# EAGLE design pogoToProg (EAGLE 7.1.0)
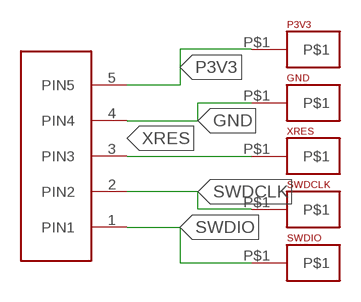
[diagram p0: schematic, sheet 1]

## Parts
GND  POGO-MATING  [POGO-MATING]
P3V3  POGO-MATING  [POGO-MATING]
SWDCLK  POGO-MATING  [POGO-MATING]
SWDIO  POGO-MATING  [POGO-MATING]
U$1  HEADER-5  [NON-5]
XRES  POGO-MATING  [POGO-MATING]

## Nets
GND: GND.P$1 U$1.4(PIN4)
P3V3: P3V3.P$1 U$1.5(PIN5)
SWDCLK: SWDCLK.P$1 U$1.2(PIN2)
SWDIO: SWDIO.P$1 U$1.1(PIN1)
XRES: U$1.3(PIN3) XRES.P$1

## Library data of the parts
GND P3V3 SWDCLK SWDIO XRES = FinalRev:POGO-MATING
U$1 = LAB1_BREAKOUT:HEADER-5: General 5 Pin 1 Row 2.54mm Spacing Connector

## Board
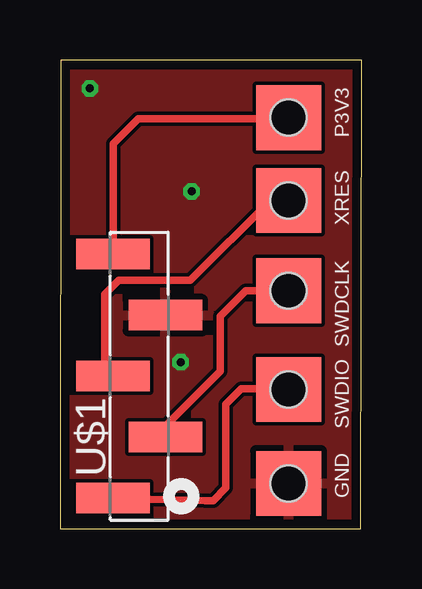
[diagram p1: board, top side]
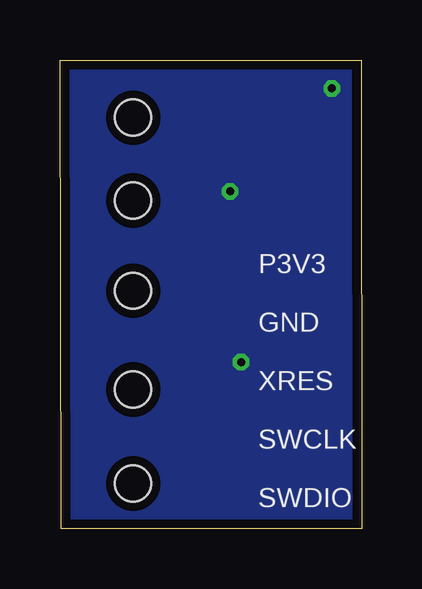
[diagram p2: board, bottom side, seen from below]

Size 12.57 x 19.52 mm. Coordinates in mm from the lower left corner, seen from the top.
Outline: 0,0 12.52,0 12.57,19.52 0.03,19.52 0,0
Copper layers (1*16): Top 0.0356mm / dielectric 1.5011mm / Bottom 0.0356mm
Design rules "LaenPCBOrder": minimum track width 6mil, minimum drill 13mil, track to track 6mil, track to pad 6mil, pad to pad 6mil, via to via 6mil, smd to smd 6mil, copper to edge 15mil, drill to drill 6mil, minimum pad ring 7mil, minimum via ring 7mil, stop-mask expansion 3mil, vias tented up to drill 0mil, thermal gap 10mil

### Footprints (pad centres in the part's own frame; a part is rotated, then mirrored left to right if it is on the bottom)
POGO-MATING = smd 2.7 x 2.7: P$1 0,0 | hole 1.5: 0,0
NON-5 = smd 1.27 x 3.061: 1 -5.08,1.086; 2 -2.54,-1.086; 3 0,1.086; 4 2.54,-1.086; 5 5.08,1.086

### Placement (x,y rotation side)
GND  9.53,1.88 270 top
P3V3  9.53,17.12 270 top
SWDCLK  9.53,9.91 270 top
SWDIO  9.53,5.79 270 top
U$1  3.3,6.35 90 top
XRES  9.53,13.67 270 top

### Tracks (layer width: path | path; a pad name or v marks a point on that pad's centre or on a via)
GND  (via drill 0.33)
  Top 0.305: GND.P$1 9.35,1.88
  other vias: 5.03,6.93 1.24,18.34 5.49,14.05
  pour Bottom: -5.99,30.96 -6.12,30.96 -6.12,-4.9 27.64,-4.9 27.64,38.02 -5.99,38.02
  pour Top: -3.63,35.99 -4.04,35.99 -4.04,-2.82 26.21,-2.82 26.21,36.55 -3.63,36.55
P3V3
  Top 0.305: P3V3.P$1 9.47,17.07 3.25,17.07 2.22,16.03 U$1.5
SWDCLK
  Top 0.305: U$1.2 4.08,3.96 6.68,6.55 6.68,8.84 7.75,9.91 SWDCLK.P$1
SWDIO
  Top 0.305: U$1.1 6.04,1.17 6.38,1.17 6.91,1.7 6.91,5.18 7.54,5.82 9.5,5.82 SWDIO.P$1
XRES
  Top 0.305: XRES.P$1 8.76,13.66 5.44,10.34 2.44,10.34 1.85,9.75 1.85,6.71 U$1.3

### Text on the board
bNames: P3V3 / / GND / / XRES / / SWCLK / / SWDIO